# Altium project Reefing System.PrjPcb
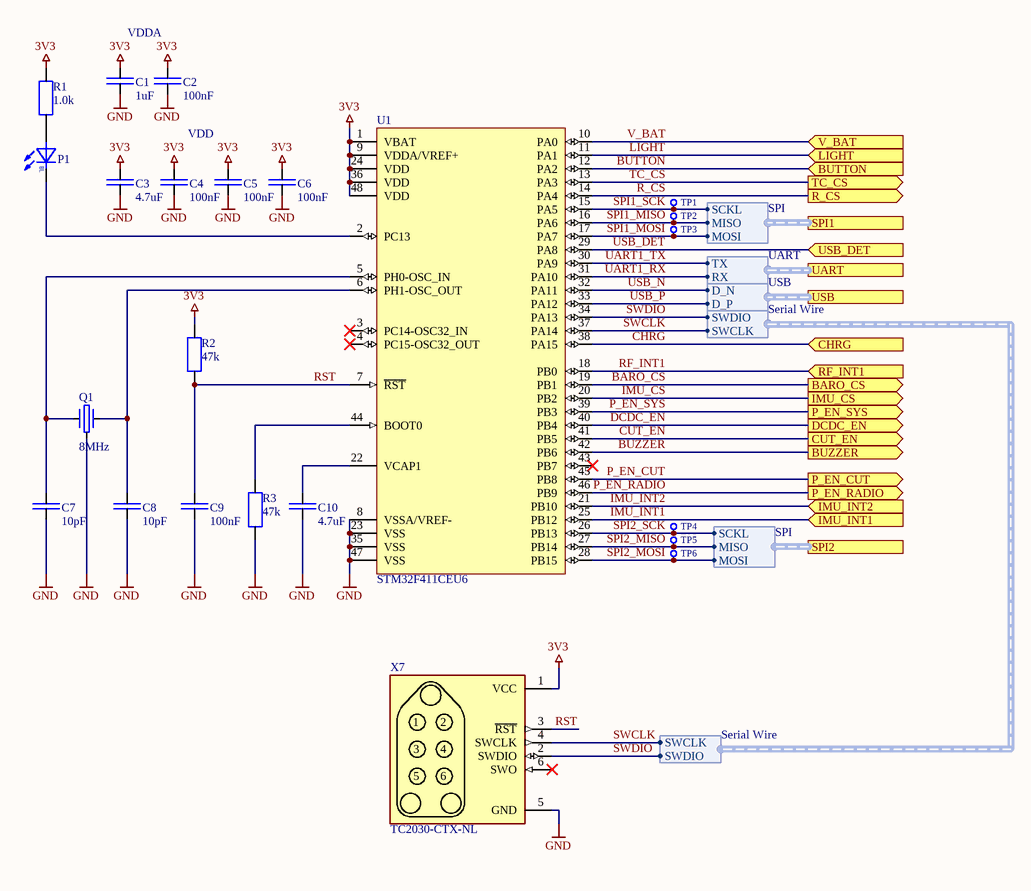
[diagram p0: Reefing-MCU.SchDoc]
8 sheets, 110 parts. Net scope: hierarchical (ports join the sheet entries above them; power ports are global).
Board file: Reefing.PcbDoc
Sheets:
  Reefing-MCU.SchDoc
  Reefing-BM.SchDoc
  Reefing-PSU.SchDoc
  Reefing-PD.SchDoc
  Reefing-Telemetry.SchDoc
  Reefing-Barometer.SchDoc
  Reefing-Thermocouple.SchDoc
  Reefing-IMU.SchDoc

## Sheet Reefing-MCU.SchDoc: Reefing System
size A4; DocumentNumber: Subtitle; Revision: V1.0; SheetNumber: 2; SheetTotal: 13; Author: Luca Jost; Subtitle: Microcontroller

### Parts
C1  1uF  [SMD Keramikkondensator 0402]
C2  100nF  [SMD Keramikkondensator 0402]
C3  4.7uF  [SMD Keramikkondensator 0402]
C4  100nF  [SMD Keramikkondensator 0402]
C5  100nF  [SMD Keramikkondensator 0402]
C6  100nF  [SMD Keramikkondensator 0402]
C7  10pF  [SMD Keramikkondensator 0402]
C8  10pF  [SMD Keramikkondensator 0402]
C9  100nF  [SMD Keramikkondensator 0402]
C10  4.7uF  [SMD Keramikkondensator 0402]
P1  LED  [SMD LED 0603]  (value not drawn)
Q1  8MHz  [SMD Crystal 3.2X2.5X0.8]
R1  1.0k  [SMD Widerstand 0402]
R2  47k  [SMD Widerstand 0402]
R3  47k  [SMD Widerstand 0402]
TP1  X-TP  [SMD Testpoint 1mm]  (value not drawn)  (no BOM)
TP2  X-TP  [SMD Testpoint 1mm]  (value not drawn)  (no BOM)
TP3  X-TP  [SMD Testpoint 1mm]  (value not drawn)  (no BOM)
TP4  X-TP  [SMD Testpoint 1mm]  (value not drawn)  (no BOM)
TP5  X-TP  [SMD Testpoint 1mm]  (value not drawn)  (no BOM)
TP6  X-TP  [SMD Testpoint 1mm]  (value not drawn)  (no BOM)
U1  STM32F411CEU6  [SMD IC QFN-48]
X7  TC2030-CTX-NL  [SMD Connector TC2030]  (no BOM)

### Ports
BARO_CS (out), BUTTON (in), BUZZER (out), CHRG (in), CUT_EN (out), DCDC_EN (out), IMU_CS (out), IMU_INT1 (in), IMU_INT2 (in), LIGHT (in), P_EN_CUT (out), P_EN_RADIO (out), P_EN_SYS (out), R_CS (out), RF_INT1 (in), SPI1 (harness SPI), SPI2 (harness SPI), TC_CS (out), UART (harness UART), USB (harness USB), USB_DET (in), V_BAT (in)

### Harnesses
SPI: MOSI, MISO, SCKL
UART: TX, RX
USB: D_P, D_N
Serial Wire: SWCLK, SWDIO
Serial Wire: SWDIO, SWCLK

### Nets
3V3: C1.2 C2.2 C3.2 C4.2 C5.2 C6.2 R1.2 R2.2 U1.1(VBAT) U1.9(VDDA/VREF+) U1.24(VDD) U1.36(VDD) U1.48(VDD) X7.1(VCC)
GND: C1.1 C2.1 C3.1 C4.1 C5.1 C6.1 C7.1 C8.1 C9.1 C10.1 Q1.3 R3.1 U1.8(VSSA/VREF-) U1.23(VSS) U1.35(VSS) U1.47(VSS) X7.5(GND)
BARO_CS: U1.19(PB1) ; port BARO_CS
BUTTON: U1.12(PA2) ; port BUTTON
BUZZER: U1.42(PB6) ; port BUZZER
CHRG: U1.38(PA15) ; port CHRG
CUT_EN: U1.41(PB5) ; port CUT_EN
DCDC_EN: U1.40(PB4) ; port DCDC_EN
IMU_CS: U1.20(PB2) ; port IMU_CS
IMU_INT1: U1.25(PB12) ; port IMU_INT1
IMU_INT2: U1.21(PB10) ; port IMU_INT2
LIGHT: U1.11(PA1) ; port LIGHT
P_EN_CUT: U1.45(PB8) ; port P_EN_CUT
P_EN_RADIO: U1.46(PB9) ; port P_EN_RADIO
P_EN_SYS: U1.39(PB3) ; port P_EN_SYS
R_CS: U1.14(PA4) ; port R_CS
RF_INT1: U1.18(PB0) ; port RF_INT1
RST: C9.2 R2.1 U1.7(~{RST}) X7.3(~{RST})
SPI1_MISO: TP2.1 U1.16(PA6) ; port SPI1.MISO
SPI1_MOSI: TP3.1 U1.17(PA7) ; port SPI1.MOSI
SPI1_SCK: TP1.1 U1.15(PA5) ; port SPI1.SCKL
SPI2_MISO: TP5.1 U1.27(PB14) ; port SPI2.MISO
SPI2_MOSI: TP6.1 U1.28(PB15) ; port SPI2.MOSI
SPI2_SCK: TP4.1 U1.26(PB13) ; port SPI2.SCKL
SWCLK: U1.37(PA14) X7.4(SWCLK) ; harness Serial Wire.SWCLK
SWDIO: U1.34(PA13) X7.2(SWDIO) ; harness Serial Wire.SWDIO
TC_CS: U1.13(PA3) ; port TC_CS
UART1_RX: U1.31(PA10) ; port UART.RX
UART1_TX: U1.30(PA9) ; port UART.TX
USB_DET: U1.29(PA8) ; port USB_DET
USB_N: U1.32(PA11) ; port USB.D_N
USB_P: U1.33(PA12) ; port USB.D_P
V_BAT: U1.10(PA0) ; port V_BAT
NetC7_2: C7.2 Q1.1 U1.5(PH0-OSC_IN)
NetC8_2: C8.2 Q1.2 U1.6(PH1-OSC_OUT)
NetC10_2: C10.2 U1.22(VCAP1)
NetP1_A: P1.A R1.1
NetP1_K: P1.K U1.2(PC13)
NetR3_2: R3.2 U1.44(BOOT0)

Not connected (* = marked no-connect by the designer): U1 3(PC14-OSC32_IN)* 4(PC15-OSC32_OUT)* 43(PB7)*; X7 6(SWO)*

### Notes on the sheet
- VDDA
- VDD
- Title
- Author:
- Subtitle
- Date:
- Rev:
- File:
- Sheet
- of
- (in symbol LED) BL

### Library data of the parts
C1 = E6 - 1uF: SMD Ceramic Capacitor E6; Unit Price: 0.01; JLC: C52923
C2 C4-C6 C9 = E6 - 100nF: SMD Ceramic Capacitor E6; Unit Price: 0.01; JLC: C307331
C3 C10 = E6 - 4.7uF: SMD Ceramic Capacitor E6; Unit Price: 0.01; JLC: C23733
C7 C8 = E6 - 10pF: SMD Ceramic Capacitor E6; Unit Price: 0.01; JLC: C32949
P1 = LED: Color LED; JLC: C72041
Q1 = Crystal: SMD Crystal Resonators 8MHz ±10ppm SMD,3.2x2.5mm; Digikey: 535-15255-1-ND; JLC: C2682775; Unit Price: 0.24
R1 = E24 - 1.0k: SMD Chip Resistor E24; Unit Price: 0.01; JLC: C11702
R2 R3 = E24 - 47k: SMD Chip Resistor E24; Unit Price: 0.01; JLC: C25792
TP1-TP6 = X-TP: Testpunkt; Unit Price: 0.00
U1 = STM32F411CEU6: ARM® Cortex®-M4 series Microcontroller IC 32-Bit 100MHz 512KB (512K x 8) FLASH 48-UFQFPN (7x7); Digikey: 497-14907-ND; JLC: C60420; ComponentLink1Description: Datasheet; ComponentLink1URL: https://datasheet.lcsc.com/lcsc/1809291612_STMicroelectronics-STM32F411CEU6_C60420.pdf; Unit Price: 7.10
X7 = TC2030-CTX-NL: Tag-Connect for ARM-Cortex (6-Pin); Unit Price: 0.00

## Sheet Reefing-BM.SchDoc: Reefing System
size A4; DocumentNumber: Subtitle; Revision: V1.0; SheetNumber: 3; SheetTotal: 13; Author: Luca Jost; Subtitle: Battery Management
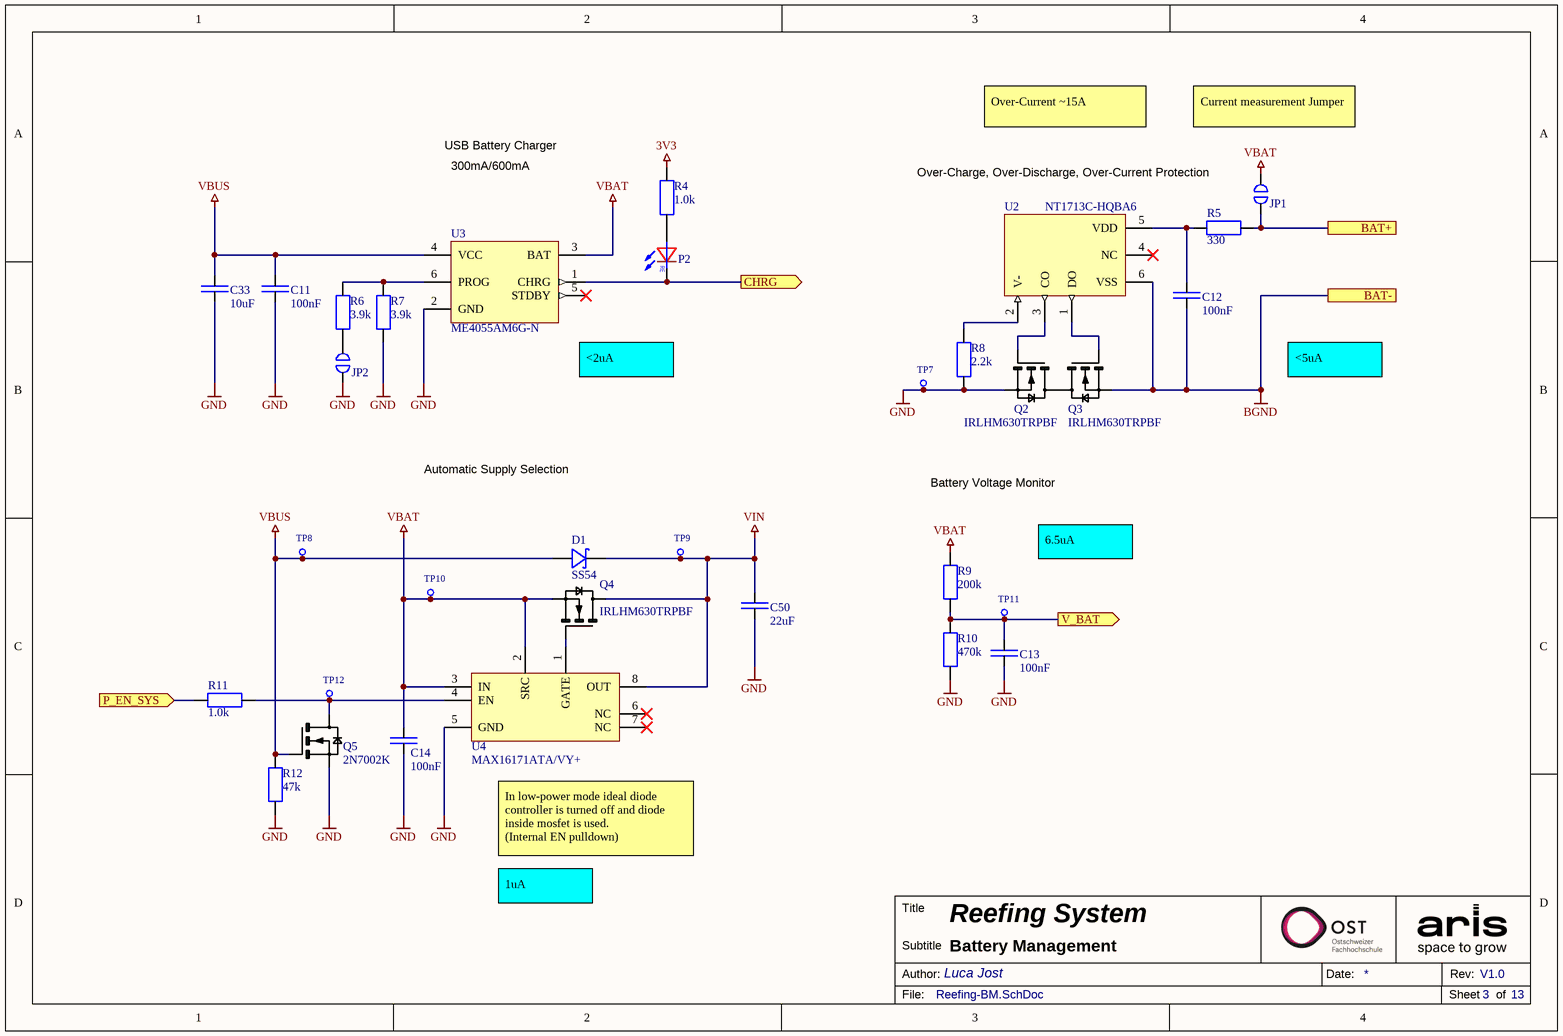
[diagram p1: Reefing-BM.SchDoc]

### Parts
C11  100nF  [SMD Keramikkondensator 0402]
C12  100nF  [SMD Keramikkondensator 0402]
C13  100nF  [SMD Keramikkondensator 0402]
C14  100nF  [SMD Keramikkondensator 0402]
C33  10uF  [SMD Keramikkondensator 0603]
C50  22uF  [SMD Keramikkondensator 0805]
D1  SS54  [SMD Diode DO-214-AC]
JP1  Jumper  [SMD Solder Jumper 1x2mm]  (value not drawn)  (no BOM)
JP2  Jumper  [SMD Solder Jumper 1x2mm]  (value not drawn)  (no BOM)
P2  LED  [SMD LED 0603]  (value not drawn)
Q2  IRLHM630TRPBF  [SMD MOSFET DFN 3.3x3.3]
Q3  IRLHM630TRPBF  [SMD MOSFET DFN 3.3x3.3]
Q4  IRLHM630TRPBF  [SMD MOSFET DFN 3.3x3.3]
Q5  2N7002K  [SMD MOSFET SOT-23]
R4  1.0k  [SMD Widerstand 0402]
R5  330  [SMD Widerstand 0402]
R6  3.9k  [SMD Widerstand 0402]
R7  3.9k  [SMD Widerstand 0402]
R8  2.2k  [SMD Widerstand 0402]
R9  200k  [SMD Widerstand 0402]
R10  470k  [SMD Widerstand 0402]
R11  1.0k  [SMD Widerstand 0402]
R12  47k  [SMD Widerstand 0402]
TP7  X-TP  [SMD Testpoint 1mm]  (value not drawn)  (no BOM)
TP8  X-TP  [SMD Testpoint 1mm]  (value not drawn)  (no BOM)
TP9  X-TP  [SMD Testpoint 1mm]  (value not drawn)  (no BOM)
TP10  X-TP  [SMD Testpoint 1mm]  (value not drawn)  (no BOM)
TP11  X-TP  [SMD Testpoint 1mm]  (value not drawn)  (no BOM)
TP12  X-TP  [SMD Testpoint 1mm]  (value not drawn)  (no BOM)
U2  NT1713C-HQBA6  [SMD IC SOT-23-6]
U3  ME4055AM6G-N  [SMD IC SOT-23-6]
U4  MAX16171ATA/VY+  [SMD IC TDFN-8]

### Ports
BAT+, BAT-, CHRG (out), P_EN_SYS (in), V_BAT (out)

### Nets
3V3: R4.2
BGND: C12.1 Q3.S U2.6(VSS) ; port BAT-
GND: C11.1 C13.1 C14.1 C33.1 C50.1 JP2.2 Q2.S Q5.S R7.1 R8.1 R10.1 R12.1 TP7.1 U3.2(GND) U4.5(GND)
VBAT: C14.2 JP1.1 Q4.S R9.2 TP10.1 U3.3(BAT) U4.2(SRC) U4.3(IN)
VBUS: C11.2 C33.2 D1.A Q5.G R12.2 TP8.1 U3.4(VCC)
VIN: C50.2 D1.K Q4.D TP9.1 U4.8(OUT)
NetC12_2: C12.2 R5.2 U2.5(VDD)
NetC13_2: C13.2 R9.1 R10.2 TP11.1 ; port V_BAT
NetJP1_2: JP1.2 R5.1 ; port BAT+
NetJP2_1: JP2.1 R6.1
NetP2_A: P2.A R4.1
NetP2_K: P2.K U3.1(CHRG) ; port CHRG
NetQ2_D: Q2.D Q3.D
NetQ2_G: Q2.G U2.3(CO)
NetQ3_G: Q3.G U2.1(DO)
NetQ4_G: Q4.G U4.1(GATE)
NetQ5_D: Q5.D R11.1 TP12.1 U4.4(EN)
NetR6_2: R6.2 R7.2 U3.6(PROG)
NetR8_2: R8.2 U2.2(V-)
NetR11_2: R11.2 ; port P_EN_SYS

Not connected (* = marked no-connect by the designer): U2 4(NC)*; U3 5(STDBY)*; U4 6(NC)* 7(NC)*

### Notes on the sheet
- USB Battery Charger
- 300mA/600mA
- (near JP1) Over-Charge, Over-Discharge, Over-Current Protection
- Over-Current ~15A
- Current measurement Jumper
- (near U3) <2uA
- <5uA
- Automatic Supply Selection
- Battery Voltage Monitor
- 6.5uA
- In low-power mode ideal diode controller is turned off and diode inside mosfet is used.
  (Internal EN pulldown)
- 1uA
- Title
- Author:
- Subtitle
- Date:
- Rev:
- File:
- Sheet
- of
- (in symbol LED) RE

### Library data of the parts
C11-C14 = E6 - 100nF: SMD Ceramic Capacitor E6; Unit Price: 0.01; JLC: C307331
C33 = E6 - 10uF: SMD Ceramic Capacitor E6; Unit Price: 0.01; JLC: C70225
C50 = E6 - 22uF: SMD Ceramic Capacitor E6; Unit Price: 0.01; JLC: C45783
D1 = SS54: 40V 5A 550mV @ 5A SMA(DO-214AC) Schottky Barrier Diodes (SBD) ROHS; ComponentLink1Description: Datasheet; ComponentLink1URL: https://datasheet.lcsc.com/lcsc/1810192041_MDD%EF%BC%88Microdiode-Electronics%EF%BC%89-SS54_C22452.pdf; JLC: C22452; Unit Price: 0.07
JP1 JP2 = Jumper-1: Single Position Jumper; Unit Price: 0.00
P2 = LED: Color LED; JLC: C2286
Q2-Q4 = IRLHM630TRPBF: N-Channel 30V 21A 3.5mOhm@4.5V; JLC: C148139; ComponentLink1Description: Datasheet; ComponentLink1URL: https://datasheet.lcsc.com/lcsc/1808281623_Infineon-Technologies-IRLHM630TRPBF_C148139.pdf; Unit Price: 0.76
Q5 = 2N7002K: MOSFET N-Channel 60V / 500mA; Digikey: 2N7002NCT-ND; ComponentLink1Description: Datasheet; ComponentLink1URL: https://www.onsemi.com/pub/Collateral/NDS7002A-D.PDF; JLC: C414015; Unit Price: 0.32
R4 R11 = E24 - 1.0k: SMD Chip Resistor E24; Unit Price: 0.01; JLC: C11702
R5 = E24 - 330: SMD Chip Resistor E24; Unit Price: 0.01; JLC: C25104
R6 R7 = E24 - 3.9k: SMD Chip Resistor E24; Unit Price: 0.01; JLC: C51721
R8 = E24 - 2.2k: SMD Chip Resistor E24; Unit Price: 0.01; Number: -; Supplier: -; JLC: C25879
R9 = E24 - 200k: SMD Chip Resistor E24; Unit Price: 0.01; JLC: C25764
R10 = E24 - 470k: SMD Chip Resistor E24; Unit Price: 0.01; JLC: C25790
R12 = E24 - 47k: SMD Chip Resistor E24; Unit Price: 0.01; JLC: C25792
TP7-TP12 = X-TP: Testpunkt; Unit Price: 0.00
U2 = NT1713C-HQBA6: Protection IC for 1-Cell Battery Pack; JLC: C596363; ComponentLink1Description: Datasheet; ComponentLink1URL: https://datasheet.lcsc.com/lcsc/2006171818_NEOTEC-NT1713C-HQBA6_C596363.pdf; Unit Price: 0.07
U3 = ME4055AM6G-N: 800mA Lithium Ion Battery Linear Charger; ComponentLink1Description: Datasheet; ComponentLink1URL: https://datasheet.lcsc.com/lcsc/1809291612_MICRONE-Nanjing-Micro-One-Elec-ME4055AM6G-N_C82121.pdf; JLC: C82121; Unit Price: 0.10
U4 = MAX16171ATA/VY+: OR Controller N+1 ORing Controller N-Channel 1:1 8-TDFN-CU (2x3); ComponentLink1Description: Datasheet; ComponentLink1URL: https://datasheets.maximintegrated.com/en/ds/MAX16171.pdf; Digikey: 175-MAX16171ATA/VY+-ND; Unit Price: 2.14

## Sheet Reefing-PSU.SchDoc: Reefing System
size A4; DocumentNumber: Subtitle; Revision: V1.0; SheetNumber: 4; SheetTotal: 13; Author: Luca Jost; Subtitle: Power Supply
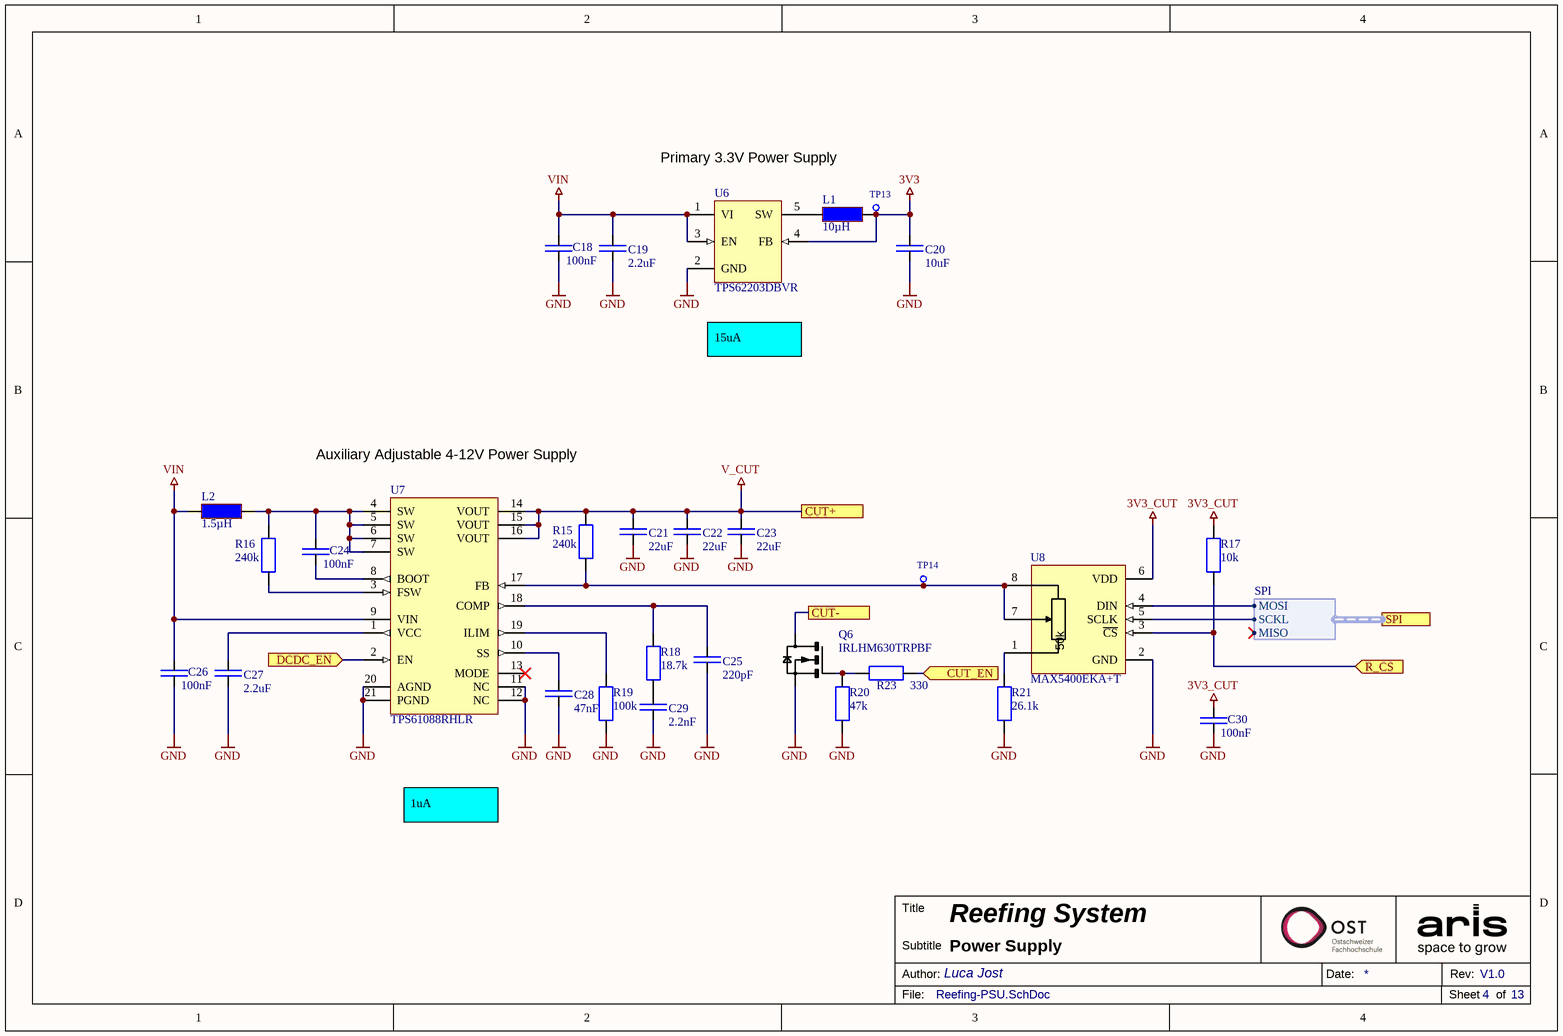
[diagram p2: Reefing-PSU.SchDoc]

### Parts
C18  100nF  [SMD Keramikkondensator 0402]
C19  2.2uF  [SMD Keramikkondensator 0402]
C20  10uF  [SMD Keramikkondensator 0603]
C21  22uF  [SMD Keramikkondensator 0805]
C22  22uF  [SMD Keramikkondensator 0805]
C23  22uF  [SMD Keramikkondensator 0805]
C24  100nF  [SMD Keramikkondensator 0402]
C25  220pF  [SMD Keramikkondensator 0402]
C26  100nF  [SMD Keramikkondensator 0402]
C27  2.2uF  [SMD Keramikkondensator 0402]
C28  47nF  [SMD Keramikkondensator 0402]
C29  2.2nF  [SMD Keramikkondensator 0402]
C30  100nF  [SMD Keramikkondensator 0402]
L1  10µH  [SMD Inductor 4x4x1.8]
L2  1.5µH  [SMD Inductor 7.1x6.6]
Q6  IRLHM630TRPBF  [SMD MOSFET DFN 3.3x3.3]
R15  240k  [SMD Widerstand 0402]
R16  240k  [SMD Widerstand 0402]
R17  10k  [SMD Widerstand 0402]
R18  18.7k  [SMD Widerstand 0402]
R19  100k  [SMD Widerstand 0402]
R20  47k  [SMD Widerstand 0402]
R21  26.1k  [SMD Widerstand 0402]
R23  330  [SMD Widerstand 0402]
TP13  X-TP  [SMD Testpoint 1mm]  (value not drawn)  (no BOM)
TP14  X-TP  [SMD Testpoint 1mm]  (value not drawn)  (no BOM)
U6  TPS62203DBVR  [SMD IC SOT-23-5]
U7  TPS61088RHLR  [SMD IC VQFN-20]
U8  MAX5400EKA+T  [SMD IC SOT-23-8]

### Ports
CUT+, CUT-, CUT_EN (in), DCDC_EN (in), R_CS (in), SPI (harness SPI)

### Harnesses
SPI: SCKL, MOSI, MISO

### Nets
3V3: C20.2 L1.2 TP13.1 U6.4(FB)
3V3_CUT: C30.2 R17.2 U8.6(VDD)
GND: C18.1 C19.1 C20.1 C21.1 C22.1 C23.1 C25.1 C26.1 C27.1 C28.1 C29.1 C30.1 Q6.S R19.1 R20.1 R21.1 U6.2(GND) U7.11(NC) U7.12(NC) U7.20(AGND) U7.21(PGND) U8.2(GND)
V_CUT: C21.2 C22.2 C23.2 R15.2 U7.14(VOUT) U7.15(VOUT) U7.16(VOUT) ; port CUT+
VIN: C18.2 C19.2 C26.2 L2.1 U6.1(VI) U6.3(EN) U7.9(VIN)
NetC24_1: C24.1 U7.8(BOOT)
NetC24_2: C24.2 L2.2 R16.2 U7.4(SW) U7.5(SW) U7.6(SW) U7.7(SW)
NetC25_2: C25.2 R18.2 U7.18(COMP)
NetC27_2: C27.2 U7.1(VCC)
NetC28_2: C28.2 U7.10(SS)
NetC29_2: C29.2 R18.1
NetL1_1: L1.1 U6.5(SW)
NetQ6_D: Q6.D ; port CUT-
NetQ6_G: Q6.G R20.2 R23.2
NetR15_1: R15.1 TP14.1 U7.17(FB) U8.7(W) U8.8(H)
NetR16_1: R16.1 U7.3(FSW)
NetR17_1: R17.1 U8.3(~{CS}) ; port R_CS
NetR19_2: R19.2 U7.19(ILIM)
NetR21_2: R21.2 U8.1(L)
NetR23_1: R23.1 ; port CUT_EN
NetU7_2: U7.2(EN) ; port DCDC_EN
NetU8_4: U8.4(DIN) ; port SPI.MOSI
NetU8_5: U8.5(SCLK) ; port SPI.SCKL

Not connected (* = marked no-connect by the designer): U7 13(MODE)*

### Notes on the sheet
- Primary 3.3V Power Supply
- 15uA
- Auxiliary Adjustable 4-12V Power Supply
- 1uA
- Title
- Author:
- Subtitle
- Date:
- Rev:
- File:
- Sheet
- of
- (in symbol MAX5400EKA+T) 50k

### Library data of the parts
C18 C24 C26 C30 = E6 - 100nF: SMD Ceramic Capacitor E6; Unit Price: 0.01; JLC: C307331
C19 C27 = E6 - 2.2uF: SMD Ceramic Capacitor E6; Unit Price: 0.01; JLC: C193620
C20 = E6 - 10uF: SMD Ceramic Capacitor E6; Unit Price: 0.01; JLC: C70225
C21-C23 = E6 - 22uF: SMD Ceramic Capacitor E6; Unit Price: 0.01; JLC: C45783
C25 = E6 - 220pF: SMD Ceramic Capacitor E6; Unit Price: 0.01; JLC: C1530
C28 = E6 - 47nF: SMD Ceramic Capacitor E6; Unit Price: 0.01; JLC: C338148
C29 = E6 - 2.2nF: SMD Ceramic Capacitor E6; Unit Price: 0.01; JLC: C1531
L1 = Inductor 10µH / 1.6A: 165mOhm SMD, 1.6A; ComponentLink1Description: Datasheet; ComponentLink1URL: https://datasheet.lcsc.com/lcsc/2108131530_SXN-Shun-Xiang-Nuo-Elec-SMNR4020-10UH_C135263.pdf; JLC: C135263; Unit Price: 0.07
L2 = Inductor 1.5µH / 10A: 8.5mΩ SMD, 7.1x6.6x5mm; ComponentLink1Description: Datasheet; ComponentLink1URL: https://datasheet.lcsc.com/lcsc/2108131730_SXN-Shun-Xiang-Nuo-Elec-SMMS0650-1R5M_C149579.pdf; JLC: C149579; Unit Price: 0.19
Q6 = IRLHM630TRPBF: N-Channel 30V 21A 3.5mOhm@4.5V; JLC: C148139; ComponentLink1Description: Datasheet; ComponentLink1URL: https://datasheet.lcsc.com/lcsc/1808281623_Infineon-Technologies-IRLHM630TRPBF_C148139.pdf; Unit Price: 0.76
R15 R16 = E24 - 240k: SMD Chip Resistor E24; Unit Price: 0.01; JLC: C64043
R17 = E24 - 10k: SMD Chip Resistor E24; Unit Price: 0.01; JLC: C25744
R18 = E96 - 18.7k: SMD Chip Resistor E96; Unit Price: 0.01; JLC: C11476
R19 = E24 - 100k: SMD Chip Resistor E24; Unit Price: 0.01; JLC: C25741
R20 = E24 - 47k: SMD Chip Resistor E24; Unit Price: 0.01; JLC: C25792
R21 = E96 - 26.1k: SMD Chip Resistor E96; Unit Price: 0.01; JLC: C407739
R23 = E24 - 330: SMD Chip Resistor E24; Unit Price: 0.01; JLC: C25104
TP13 TP14 = X-TP: Testpunkt; Unit Price: 0.00
U6 = TPS62203DBVR: High-Efficiency Synchronous Step-Down / synchronous step-down converters ideally suited for Converter 3.3V; ComponentLink1Description: Datasheet; ComponentLink1URL: https://www.ti.com/lit/ds/symlink/tps62203.pdf?HQS=dis-mous-null-mousermode-dsf-pf-null-wwe&ts=1645451444570&ref_url=https%253A%252F%252Fwww.mouser.ch%252F; JLC: C9051; Unit Price: 1.03
U7 = TPS61088RHLR: 10-A Fully-Integrated Synchronous Boost Converter; ComponentLink1Description: Datasheet; ComponentLink1URL: https://www.ti.com/lit/ds/symlink/tps61088.pdf?HQS=dis-mous-null-mousermode-dsf-pf-null-wwe&ts=1645456492039&ref_url=https%253A%252F%252Fwww.mouser.ch%252F; JLC: C87357; Unit Price: 2.57
U8 = MAX5400EKA+T: Low-Drift Digital Potentiometer; ComponentLink1Description: Datasheet; ComponentLink1URL: https://datasheet.lcsc.com/lcsc/2105241240_Maxim-Integrated-MAX5400EKA-T_C516784.pdf; JLC: C516784; Unit Price: 1.99

## Sheet Reefing-PD.SchDoc: Reefing System
size A4; DocumentNumber: Subtitle; Revision: V1.0; SheetNumber: 5; SheetTotal: 13; Author: Luca Jost; Subtitle: Power Distribution
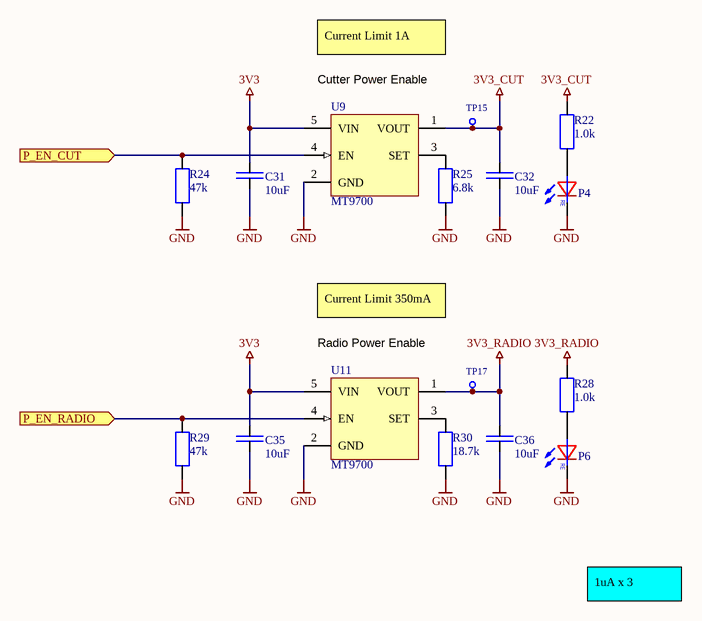
[diagram p3: Reefing-PD.SchDoc]

### Parts
C31  10uF  [SMD Keramikkondensator 0603]
C32  10uF  [SMD Keramikkondensator 0603]
C35  10uF  [SMD Keramikkondensator 0603]
C36  10uF  [SMD Keramikkondensator 0603]
P4  LED  [SMD LED 0603]  (value not drawn)
P6  LED  [SMD LED 0603]  (value not drawn)
R22  1.0k  [SMD Widerstand 0402]
R24  47k  [SMD Widerstand 0402]
R25  6.8k  [SMD Widerstand 0402]
R28  1.0k  [SMD Widerstand 0402]
R29  47k  [SMD Widerstand 0402]
R30  18.7k  [SMD Widerstand 0402]
TP15  X-TP  [SMD Testpoint 1mm]  (value not drawn)  (no BOM)
TP17  X-TP  [SMD Testpoint 1mm]  (value not drawn)  (no BOM)
U9  MT9700  [SMD IC SOT-23-5]
U11  MT9700  [SMD IC SOT-23-5]

### Ports
P_EN_CUT (in), P_EN_RADIO (in)

### Nets
3V3: C31.2 C35.2 U9.5(VIN) U11.5(VIN)
3V3_CUT: C32.2 R22.2 TP15.1 U9.1(VOUT)
3V3_RADIO: C36.2 R28.2 TP17.1 U11.1(VOUT)
GND: C31.1 C32.1 C35.1 C36.1 P4.K P6.K R24.1 R25.1 R29.1 R30.1 U9.2(GND) U11.2(GND)
NetP4_A: P4.A R22.1
NetP6_A: P6.A R28.1
NetR24_2: R24.2 U9.4(EN) ; port P_EN_CUT
NetR25_2: R25.2 U9.3(SET)
NetR29_2: R29.2 U11.4(EN) ; port P_EN_RADIO
NetR30_2: R30.2 U11.3(SET)

### Notes on the sheet
- Cutter Power Enable
- Current Limit 1A
- Radio Power Enable
- Current Limit 350mA
- 1uA x 3
- Title
- Author:
- Subtitle
- Date:
- Rev:
- File:
- Sheet
- of
- (in symbol LED) RE

### Library data of the parts
C31 C32 C35 C36 = E6 - 10uF: SMD Ceramic Capacitor E6; Unit Price: 0.01; JLC: C70225
P4 P6 = LED: Color LED; JLC: C2286
R22 R28 = E24 - 1.0k: SMD Chip Resistor E24; Unit Price: 0.01; JLC: C11702
R24 R29 = E24 - 47k: SMD Chip Resistor E24; Unit Price: 0.01; JLC: C25792
R25 = E24 - 6.8k: SMD Chip Resistor E24; Unit Price: 0.01; JLC: C25917
R30 = E96 - 18.7k: SMD Chip Resistor E96; Unit Price: 0.01; JLC: C11476
TP15 TP17 = X-TP: Testpunkt; Unit Price: 0.00
U9 U11 = MT9700: Power Distribution Switch; ComponentLink1Description: Datasheet; ComponentLink1URL: https://datasheet.lcsc.com/lcsc/1809291208_XI-AN-Aerosemi-Tech-MT9700_C89855.pdf; JLC: C89855; Unit Price: 0.11

## Sheet Reefing-Telemetry.SchDoc: Reefing System
size A4; DocumentNumber: Subtitle; Revision: V1.0; SheetNumber: 6; SheetTotal: 13; Author: Luca Jost; Subtitle: Telemetry
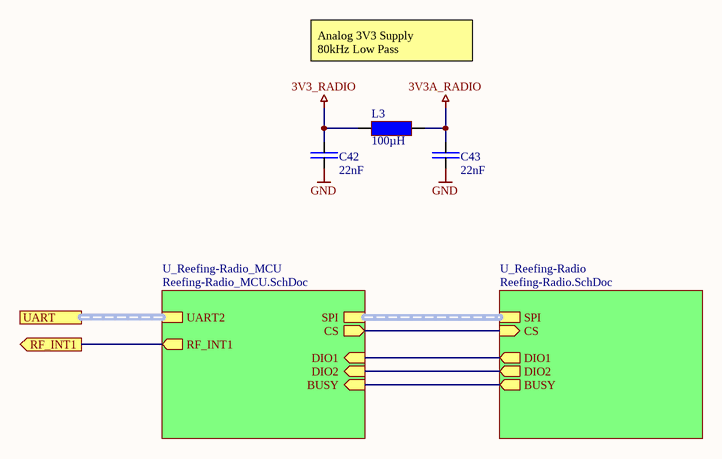
[diagram p4: Reefing-Telemetry.SchDoc]

### Parts
C42  22nF  [SMD Keramikkondensator 0805]
C43  22nF  [SMD Keramikkondensator 0805]
L3  100µH  [SMD Inductor 1812]

### Sub-sheets
U_Reefing-Radio = Reefing-Radio.SchDoc (file not in this document): SPI (harness SPI), CS (in), BUSY (out), DIO1 (out), DIO2 (out)
U_Reefing-Radio_MCU = Reefing-Radio_MCU.SchDoc (file not in this document): SPI (harness SPI), RF_INT1 (out), UART2 (harness UART), BUSY (in), DIO2 (in), DIO1 (in), CS (out)

### Ports
RF_INT1 (out), UART

### Nets
3V3_RADIO: C42.2 L3.1
3V3A_RADIO: C43.2 L3.2
GND: C42.1 C43.1
(unnamed): port RF_INT1, sheet U_Reefing-Radio_MCU/RF_INT1
(unnamed): sheet U_Reefing-Radio/CS, sheet U_Reefing-Radio_MCU/CS
(unnamed): sheet U_Reefing-Radio/BUSY, sheet U_Reefing-Radio_MCU/BUSY
(unnamed): sheet U_Reefing-Radio/DIO1, sheet U_Reefing-Radio_MCU/DIO1
(unnamed): sheet U_Reefing-Radio/DIO2, sheet U_Reefing-Radio_MCU/DIO2

### Buses and harness runs
harness port UART = sheet U_Reefing-Radio_MCU/UART2
harness sheet U_Reefing-Radio/SPI = sheet U_Reefing-Radio_MCU/SPI

### Notes on the sheet
- Analog 3V3 Supply
  80kHz Low Pass
- Title
- Author:
- Subtitle
- Date:
- Rev:
- File:
- Sheet
- of

### Library data of the parts
C42 C43 = E6 - 22nF: SMD Ceramic Capacitor E6; Unit Price: 0.01; JLC: C1729
L3 = Inductor 100µH / 0.25A: 0.25A 100µH ±20% 144mΩ SMD Power Inductors; ComponentLink1Description: Datasheet; ComponentLink1URL: https://datasheet.lcsc.com/lcsc/2110081330_Sunlord-SPH252012H3R3MT_C98379.pdf; JLC: C76822; Unit Price: 0.19

## Sheet Reefing-Barometer.SchDoc: Reefing System
size A4; DocumentNumber: Subtitle; Revision: V1.0; SheetNumber: 9; SheetTotal: 13; Author: Luca Jost; Subtitle: Barometer
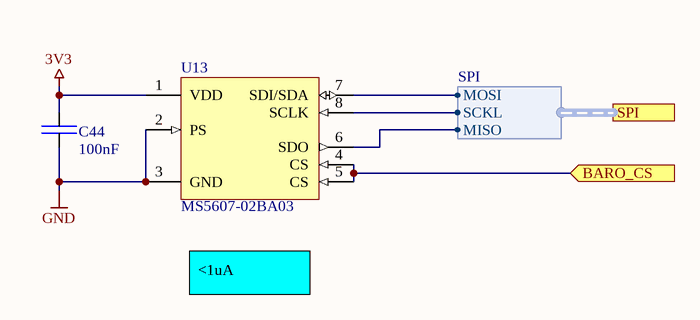
[diagram p5: Reefing-Barometer.SchDoc]

### Parts
C44  100nF  [SMD Keramikkondensator 0402]
U13  MS5607-02BA03  [SMD IC BARO MS5607]

### Ports
BARO_CS (in), SPI (harness SPI)

### Harnesses
SPI: SCKL, MOSI, MISO

### Nets
3V3: C44.2 U13.1(VDD)
GND: C44.1 U13.2(PS) U13.3(GND)
NetU13_4: U13.4(CS) U13.5(CS) ; port BARO_CS
NetU13_6: U13.6(SDO) ; port SPI.MISO
NetU13_7: U13.7(SDI/SDA) ; port SPI.MOSI
NetU13_8: U13.8(SCLK) ; port SPI.SCKL

### Notes on the sheet
- <1uA
- Title
- Author:
- Subtitle
- Date:
- Rev:
- File:
- Sheet
- of

### Library data of the parts
C44 = E6 - 100nF: SMD Ceramic Capacitor E6; Unit Price: 0.01; JLC: C307331
U13 = MS5607-02BA03: Barometric Pressure Sensor, with stainless / steel cap; ComponentLink1Description: Datasheet; ComponentLink1URL: https://www.te.com/commerce/DocumentDelivery/DDEController?Action=srchrtrv&DocNm=MS5607-02BA03&DocType=Data+Sheet&DocLang=English; Digikey: 223-1198-1-ND; Unit Price: 5.63

## Sheet Reefing-Thermocouple.SchDoc: Reefing System
size A4; DocumentNumber: Subtitle; Revision: V1.0; SheetNumber: 10; SheetTotal: 13; Author: Luca Jost; Subtitle: Thermocouple
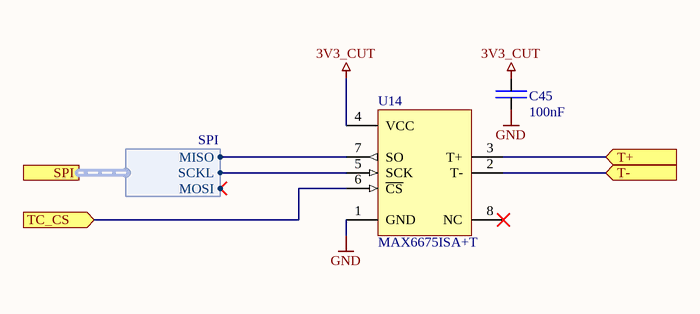
[diagram p6: Reefing-Thermocouple.SchDoc]

### Parts
C45  100nF  [SMD Keramikkondensator 0402]
U14  MAX6675ISA+T  [SMD IC SOIC-8]

### Ports
SPI (harness SPI), T+ (in), T- (in), TC_CS (in)

### Harnesses
SPI: SCKL, MOSI, MISO

### Nets
3V3_CUT: C45.2 U14.4(VCC)
GND: C45.1 U14.1(GND)
NetU14_2: U14.2(T-) ; port T-
NetU14_3: U14.3(T+) ; port T+
NetU14_5: U14.5(SCK) ; port SPI.SCKL
NetU14_6: U14.6(~{CS}) ; port TC_CS
NetU14_7: U14.7(SO) ; port SPI.MISO

Not connected (* = marked no-connect by the designer): U14 8(NC)*

### Notes on the sheet
- Title
- Author:
- Subtitle
- Date:
- Rev:
- File:
- Sheet
- of

### Library data of the parts
C45 = E6 - 100nF: SMD Ceramic Capacitor E6; Unit Price: 0.01; JLC: C307331
U14 = MAX6675ISA+T: Cold-Junction-Compensated K-Thermocoupleto-Digital Converter; ComponentLink1Description: Datasheet; ComponentLink1URL: https://datasheet.lcsc.com/lcsc/1810181421_Maxim-Integrated-MAX6675ISA-T_C16030.pdf; JLC: C16030; Unit Price: 2.95

## Sheet Reefing-IMU.SchDoc: Reefing System
size A4; DocumentNumber: Subtitle; Revision: V1.0; SheetNumber: 11; SheetTotal: 13; Author: Luca Jost; Subtitle: Inertial Measurement Unit
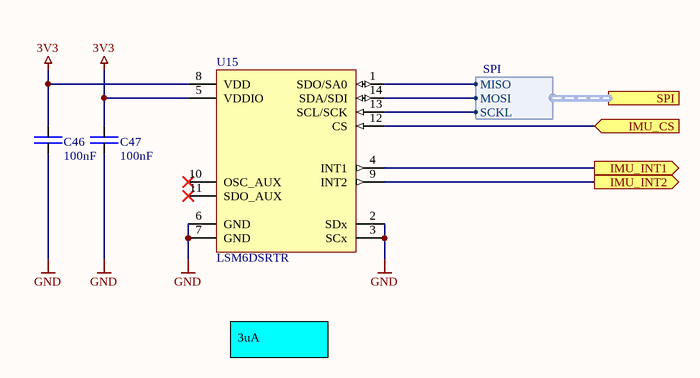
[diagram p7: Reefing-IMU.SchDoc]

### Parts
C46  100nF  [SMD Keramikkondensator 0402]
C47  100nF  [SMD Keramikkondensator 0402]
U15  LSM6DSRTR  [SMD IC LGA-14]

### Ports
IMU_CS (in), IMU_INT1 (out), IMU_INT2 (out), SPI (harness SPI)

### Harnesses
SPI: SCKL, MOSI, MISO

### Nets
3V3: C46.2 C47.2 U15.5(VDDIO) U15.8(VDD)
GND: C46.1 C47.1 U15.2(SDx) U15.3(SCx) U15.6(GND) U15.7(GND)
NetU15_1: U15.1(SDO/SA0) ; port SPI.MISO
NetU15_4: U15.4(INT1) ; port IMU_INT1
NetU15_9: U15.9(INT2) ; port IMU_INT2
NetU15_12: U15.12(CS) ; port IMU_CS
NetU15_13: U15.13(SCL/SCK) ; port SPI.SCKL
NetU15_14: U15.14(SDA/SDI) ; port SPI.MOSI

Not connected (* = marked no-connect by the designer): U15 10(OSC_AUX)* 11(SDO_AUX)*

### Notes on the sheet
- 3uA
- Title
- Author:
- Subtitle
- Date:
- Rev:
- File:
- Sheet
- of

### Library data of the parts
C46 C47 = E6 - 100nF: SMD Ceramic Capacitor E6; Unit Price: 0.01; JLC: C307331
U15 = LSM6DSRTR: Accelerometer, Gyroscope, Temperature, 6 Axis Sensor I²C, SPI Output; ComponentLink1Description: Datasheet; ComponentLink1URL: https://datasheet.lcsc.com/lcsc/2201131130_STMicroelectronics-LSM6DSRTR_C784817.pdf; JLC: C784817; Unit Price: 4.88

## Nets that join several sheets
3V3: Reefing-MCU (14 pins), Reefing-BM (R4.2), Reefing-PSU (C20.2 L1.2 TP13.1 U6.4), Reefing-PD (C31.2 C35.2 U9.5 U11.5), Reefing-Barometer (C44.2 U13.1), Reefing-IMU (C46.2 C47.2 U15.5 U15.8)
3V3_CUT: Reefing-PSU (C30.2 R17.2 U8.6), Reefing-PD (C32.2 R22.2 TP15.1 U9.1), Reefing-Thermocouple (C45.2 U14.4)
3V3_RADIO: Reefing-PD (C36.2 R28.2 TP17.1 U11.1), Reefing-Telemetry (C42.2 L3.1)
GND: Reefing-MCU (17 pins), Reefing-BM (15 pins), Reefing-PSU (22 pins), Reefing-PD (12 pins), Reefing-Telemetry (C42.1 C43.1), Reefing-Barometer (C44.1 U13.2 U13.3), Reefing-Thermocouple (C45.1 U14.1), Reefing-IMU (6 pins)
VIN: Reefing-BM (5 pins), Reefing-PSU (7 pins)